# EAGLE schematic RS485_v1 (EAGLE 6.2)
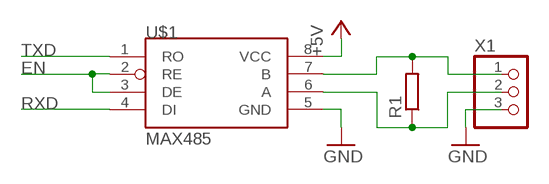
[diagram p0: schematic, sheet 1]

## Parts
R1  R-EU_R0805  [R0805]
U$1  MAX485  [SO08]
X1  W237-103  [W237-103]

## Nets
+5V: U$1.8(VCC)
EN: U$1.2(RE) U$1.3(DE)
GND: U$1.5(GND) X1.3
N$1: R1.2 U$1.7(B) X1.1
N$2: R1.1 U$1.6(A) X1.2
RXD: U$1.4(DI)
TXD: U$1.1(RO)

## Library data of the parts
R1 = mark_1:R-EU_: RESISTOR, European symbol
U$1 = mark_1:MAX485
X1 = mark_1:W237-103: WAGO SCREW CLAMP